# Altium schematic sheet A3000_16MB.SchDoc: ARM2 to ARM3 Adapter
size A3; DocumentNumber: 1; SheetNumber: 2; SheetTotal: 5
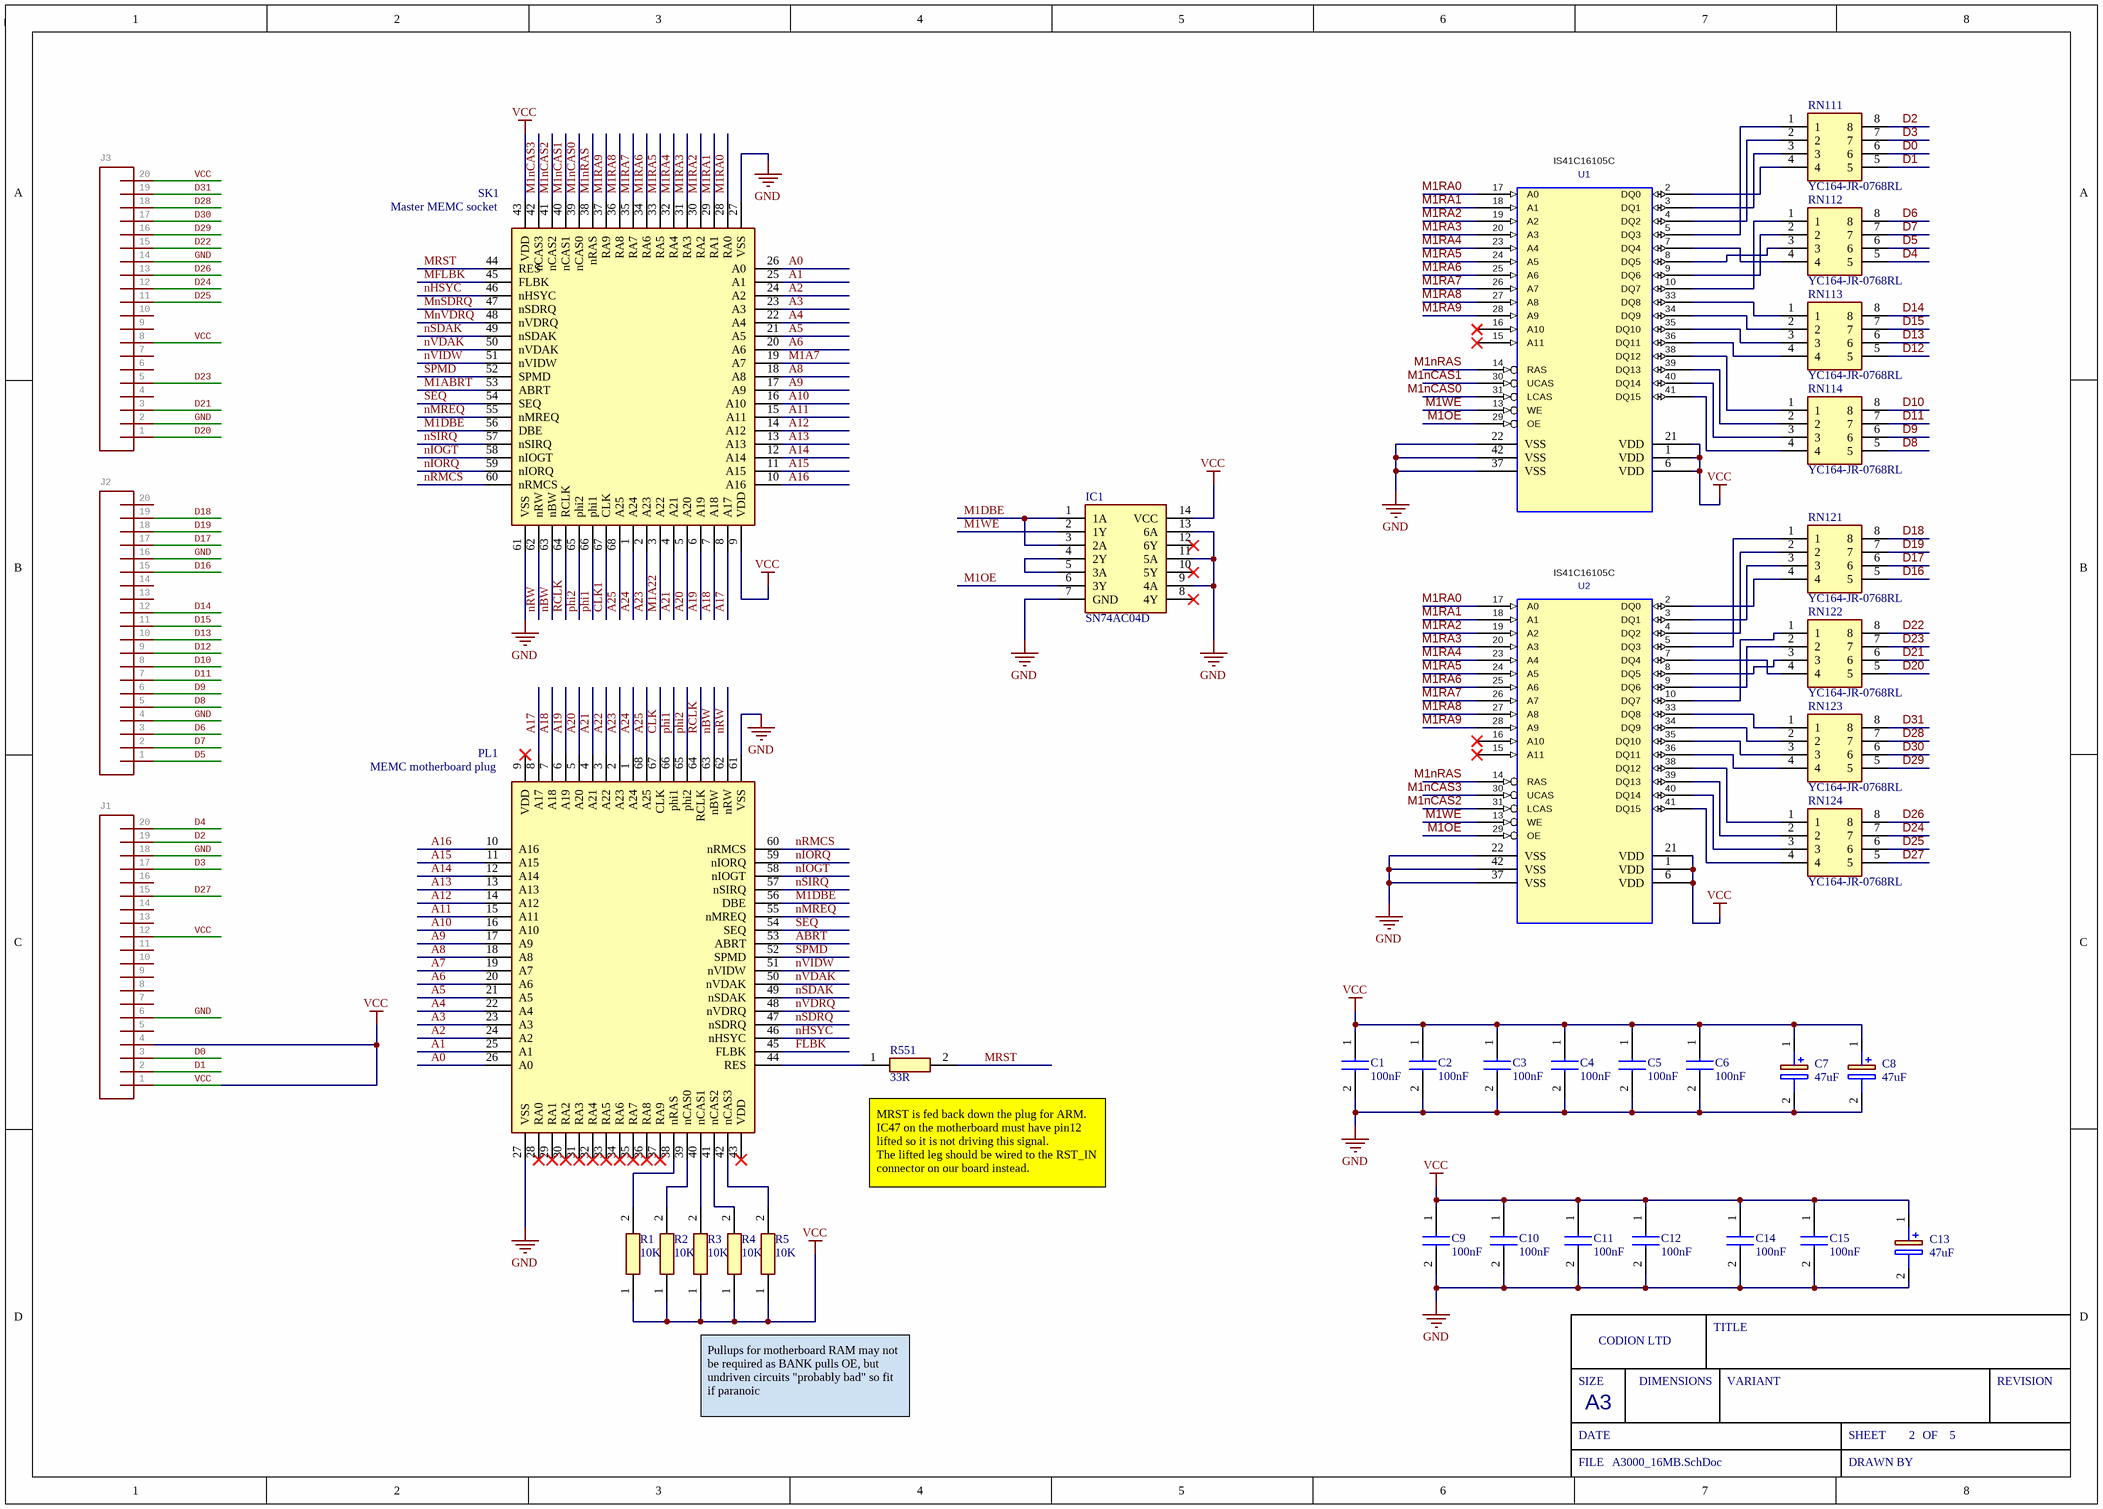
[diagram p0: A3000_16MB.SchDoc]

## Parts
C1  100nF  [CAPC2012X145N]
C2  100nF  [CAPC2012X145N]
C3  100nF  [CAPC2012X145N]
C4  100nF  [CAPC2012X145N]
C5  100nF  [CAPC2012X145N]
C6  100nF  [CAPC2012X145N]
C7  47uF  [EEE1AA101SP]
C8  47uF  [EEE1AA101SP]
C9  100nF  [CAPC2012X145N]
C10  100nF  [CAPC2012X145N]
C11  100nF  [CAPC2012X145N]
C12  100nF  [CAPC2012X145N]
C13  47uF  [EEE1AA101SP]
C14  100nF  [CAPC2012X145N]
C15  100nF  [CAPC2012X145N]
IC1  SN74AC04D  [SOIC127P600X175-14N]
J1  CONN_20  [1X20]  (value not drawn)
J2  CONN_20  [1X20]  (value not drawn)
J3  CONN_20  [1X20]  (value not drawn)
PL1  MEMC motherboard plug  [MEMC_Plug]
R1  10K  [RESC1005X40N]
R2  10K  [RESC1005X40N]
R3  10K  [RESC1005X40N]
R4  10K  [RESC1005X40N]
R5  10K  [RESC1005X40N]
R551  33R  [RESC1005X40N]
RN111  YC164-JR-0768RL  [YC164JR0768RL]
RN112  YC164-JR-0768RL  [YC164JR0768RL]
RN113  YC164-JR-0768RL  [YC164JR0768RL]
RN114  YC164-JR-0768RL  [YC164JR0768RL]
RN121  YC164-JR-0768RL  [YC164JR0768RL]
RN122  YC164-JR-0768RL  [YC164JR0768RL]
RN123  YC164-JR-0768RL  [YC164JR0768RL]
RN124  YC164-JR-0768RL  [YC164JR0768RL]
SK1  Master MEMC socket  [MEMC_Socket]
U1  IS41C16105C  [SOJ-42]
U2  IS41C16105C  [SOJ-42]

## Nets
GND: C1.2 C2.2 C3.2 C4.2 C5.2 C6.2 C7.2(-) C8.2(-) C9.2 C10.2 C11.2 C12.2 C13.2(-) C14.2 C15.2 IC1.7(GND) IC1.9(4A) IC1.11(5A) IC1.13(6A) J1.6 J1.18 J2.4 J2.16 J3.2 J3.14 PL1.27(VSS) PL1.61(VSS) SK1.27(VSS) SK1.61(VSS) U1.22(VSS) U1.37(VSS) U1.42(VSS) U2.22(VSS) U2.37(VSS) U2.42(VSS)
VCC: C1.1 C2.1 C3.1 C4.1 C5.1 C6.1 C7.1(+) C8.1(+) C9.1 C10.1 C11.1 C12.1 C13.1(+) C14.1 C15.1 IC1.14(VCC) J1.1 J1.4 J1.12 J3.8 J3.20 R1.1 R2.1 R3.1 R4.1 R5.1 SK1.9(VDD) SK1.43(VDD) U1.1(VCC) U1.6(VCC) U1.21(VCC) U2.1(VCC) U2.6(VCC) U2.21(VCC)
A0: PL1.26(A0) SK1.26(A0)
A1: PL1.25(A1) SK1.25(A1)
A2: PL1.24(A2) SK1.24(A2)
A3: PL1.23(A3) SK1.23(A3)
A4: PL1.22(A4) SK1.22(A4)
A5: PL1.21(A5) SK1.21(A5)
A6: PL1.20(A6) SK1.20(A6)
A7: PL1.19(A7)
A8: PL1.18(A8) SK1.18(A8)
A9: PL1.17(A9) SK1.17(A9)
A10: PL1.16(A10) SK1.16(A10)
A11: PL1.15(A11) SK1.15(A11)
A12: PL1.14(A12) SK1.14(A12)
A13: PL1.13(A13) SK1.13(A13)
A14: PL1.12(A14) SK1.12(A14)
A15: PL1.11(A15) SK1.11(A15)
A16: PL1.10(A16) SK1.10(A16)
A17: PL1.8(A17) SK1.8(A17)
A18: PL1.7(A18) SK1.7(A18)
A19: PL1.6(A19) SK1.6(A19)
A20: PL1.5(A20) SK1.5(A20)
A21: PL1.4(A21) SK1.4(A21)
A22: PL1.3(A22)
A23: PL1.2(A23) SK1.2(A23)
A24: PL1.1(A24) SK1.1(A24)
A25: PL1.68(A25) SK1.68(A25)
ABRT: PL1.53(ABRT)
CLK: PL1.67(CLK)
CLK1: SK1.67(CLK)
D0: J1.3 RN111.6
D1: J1.2 RN111.5
D2: J1.19 RN111.8
D3: J1.17 RN111.7
D4: J1.20 RN112.5
D5: J2.1 RN112.6
D6: J2.3 RN112.8
D7: J2.2 RN112.7
D8: J2.5 RN114.5
D9: J2.6 RN114.6
D10: J2.8 RN114.8
D11: J2.7 RN114.7
D12: J2.9 RN113.5
D13: J2.10 RN113.6
D14: J2.12 RN113.8
D15: J2.11 RN113.7
D16: J2.15 RN121.5
D17: J2.17 RN121.6
D18: J2.19 RN121.8
D19: J2.18 RN121.7
D20: J3.1 RN122.5
D21: J3.3 RN122.6
D22: J3.15 RN122.8
D23: J3.5 RN122.7
D24: J3.12 RN124.7
D25: J3.11 RN124.6
D26: J3.13 RN124.8
D27: J1.15 RN124.5
D28: J3.18 RN123.7
D29: J3.16 RN123.5
D30: J3.17 RN123.6
D31: J3.19 RN123.8
FLBK: PL1.45(FLBK)
M1A7: SK1.19(A7)
M1A22: SK1.3(A22)
M1ABRT: SK1.53(ABRT)
M1DBE: IC1.1(1A) IC1.3(2A) PL1.56(DBE) SK1.56(DBE)
M1nCAS0: SK1.39(nCAS0) U1.31(LCAS)
M1nCAS1: SK1.40(nCAS1) U1.30(UCAS)
M1nCAS2: SK1.41(nCAS2) U2.31(LCAS)
M1nCAS3: SK1.42(nCAS3) U2.30(UCAS)
M1nRAS: SK1.38(nRAS) U1.14(RAS) U2.14(RAS)
M1OE: IC1.6(3Y) U1.29(OE) U2.29(OE)
M1RA0: SK1.28(RA0) U1.17(A0) U2.17(A0)
M1RA1: SK1.29(RA1) U1.18(A1) U2.18(A1)
M1RA2: SK1.30(RA2) U1.19(A2) U2.19(A2)
M1RA3: SK1.31(RA3) U1.20(A3) U2.20(A3)
M1RA4: SK1.32(RA4) U1.23(A4) U2.23(A4)
M1RA5: SK1.33(RA5) U1.24(A5) U2.24(A5)
M1RA6: SK1.34(RA6) U1.25(A6) U2.25(A6)
M1RA7: SK1.35(RA7) U1.26(A7) U2.26(A7)
M1RA8: SK1.36(RA8) U1.27(A8) U2.27(A8)
M1RA9: SK1.37(RA9) U1.28(A9) U2.28(A9)
M1WE: IC1.2(1Y) U1.13(WE) U2.13(WE)
MFLBK: SK1.45(FLBK)
MnSDRQ: SK1.47(nSDRQ)
MnVDRQ: SK1.48(nVDRQ)
MRST: R551.2 SK1.44(RES)
nBW: PL1.63(nBW) SK1.63(nBW)
nHSYC: PL1.46(nHSYC) SK1.46(nHSYC)
nIOGT: PL1.58(nIOGT) SK1.58(nIOGT)
nIORQ: PL1.59(nIORQ) SK1.59(nIORQ)
nMREQ: PL1.55(nMREQ) SK1.55(nMREQ)
nRMCS: PL1.60(nRMCS) SK1.60(nRMCS)
nRW: PL1.62(nRW) SK1.62(nRW)
nSDAK: PL1.49(nSDAK) SK1.49(nSDAK)
nSDRQ: PL1.47(nSDRQ)
nSIRQ: PL1.57(nSIRQ) SK1.57(nSIRQ)
nVDAK: PL1.50(nVDAK) SK1.50(nVDAK)
nVDRQ: PL1.48(nVDRQ)
nVIDW: PL1.51(nVIDW) SK1.51(nVIDW)
phi1: PL1.66(phi1) SK1.66(phi1)
phi2: PL1.65(phi2) SK1.65(phi2)
RCLK: PL1.64(RCLK) SK1.64(RCLK)
SEQ: PL1.54(SEQ) SK1.54(SEQ)
SPMD: PL1.52(SPMD) SK1.52(SPMD)
NetIC1_4: IC1.4(2Y) IC1.5(3A)
NetPL1_38: PL1.38(nRAS) R1.2
NetPL1_39: PL1.39(nCAS0) R2.2
NetPL1_40: PL1.40(nCAS1) R3.2
NetPL1_41: PL1.41(nCAS2) R4.2
NetPL1_42: PL1.42(nCAS3) R5.2
NetPL1_44: PL1.44(RES) R551.1
NetRN111_1: RN111.1 U1.5(DQ3)
NetRN111_2: RN111.2 U1.4(DQ2)
NetRN111_3: RN111.3 U1.3(DQ1)
NetRN111_4: RN111.4 U1.2(DQ0)
NetRN112_1: RN112.1 U1.10(DQ7)
NetRN112_2: RN112.2 U1.9(DQ6)
NetRN112_3: RN112.3 U1.8(DQ5)
NetRN112_4: RN112.4 U1.7(DQ4)
NetRN113_1: RN113.1 U1.33(DQ8)
NetRN113_2: RN113.2 U1.34(DQ9)
NetRN113_3: RN113.3 U1.35(DQ10)
NetRN113_4: RN113.4 U1.36(DQ11)
NetRN114_1: RN114.1 U1.38(DQ12)
NetRN114_2: RN114.2 U1.39(DQ13)
NetRN114_3: RN114.3 U1.40(DQ14)
NetRN114_4: RN114.4 U1.41(DQ15)
NetRN121_1: RN121.1 U2.5(DQ3)
NetRN121_2: RN121.2 U2.4(DQ2)
NetRN121_3: RN121.3 U2.3(DQ1)
NetRN121_4: RN121.4 U2.2(DQ0)
NetRN122_1: RN122.1 U2.10(DQ7)
NetRN122_2: RN122.2 U2.9(DQ6)
NetRN122_3: RN122.3 U2.8(DQ5)
NetRN122_4: RN122.4 U2.7(DQ4)
NetRN123_1: RN123.1 U2.33(DQ8)
NetRN123_2: RN123.2 U2.34(DQ9)
NetRN123_3: RN123.3 U2.35(DQ10)
NetRN123_4: RN123.4 U2.36(DQ11)
NetRN124_1: RN124.1 U2.38(DQ12)
NetRN124_2: RN124.2 U2.39(DQ13)
NetRN124_3: RN124.3 U2.40(DQ14)
NetRN124_4: RN124.4 U2.41(DQ15)

Not connected (* = marked no-connect by the designer): IC1 8(4Y)* 10(5Y)* 12(6Y)*; J1 5 7 8 9 10 11 13 14 16; J2 13 14 20; J3 4 6 7 9 10; PL1 9(VDD)* 28(RA0)* 29(RA1)* 30(RA2)* 31(RA3)* 32(RA4)* 33(RA5)* 34(RA6)* 35(RA7)* 36(RA8)* 37(RA9)* 43(VDD)*; U1 15(A11)* 16(A10)*; U2 15(A11)* 16(A10)*

## Notes on the sheet
- (near R551) MRST is fed back down the plug for ARM.
  IC47 on the motherboard must have pin12 lifted so it is not driving this signal.
  The lifted leg should be wired to the RST_IN connector on our board instead.
- Pullups for motherboard RAM may not be required as BANK pulls OE, but undriven circuits "probably bad" so fit if paranoic
- SIZE
- CODION LTD
- DIMENSIONS
- TITLE
- VARIANT
- REVISION
- DATE
- A3
- SHEET
- OF
- FILE
- DRAWN BY

## Library data of the parts
C1-C6 C9-C12 C14 C15 = C2012X7R1H104K125AM: Capacitor; Manufacturer_Name: TDK; Datasheet Link: https://product.tdk.com/info/en/catalog/datasheets/mlcc_commercial_midvoltage_en.pdf; Height: 1.45mm; Manufacturer_Part_Number: C2012X7R1H104K125AM; Mouser Part Number: 810-C2012X7R1H104KT5; Mouser Price/Stock: https://www.mouser.com/Search/Refine.aspx?Keyword=810-C2012X7R1H104KT5; Arrow Part Number: C2012X7R1H104K125AM; Arrow Price/Stock: https://www.arrow.com/en/products/c2012x7r1h104k125am/tdk; LCSC Part #: C111492
C7 C8 C13 = EEE1VA470WP: Capacitor Polarised; Manufacturer_Name: Panasonic; Datasheet Link: http://industrial.panasonic.com/cdbs/www-data/pdf/RDE0000/ABA0000C1145.pdf; Height: 7.8mm; Manufacturer_Part_Number: EEE1VA470WP
IC1 = SN74AC04D: Integrated Circuit; Manufacturer_Name: Texas Instruments; Datasheet Link: http://www.ti.com/lit/ds/symlink/sn74ac04.pdf; Height: 1.75mm; Manufacturer_Part_Number: SN74AC04D; Mouser Part Number: 595-SN74AC04D; Mouser Price/Stock: https://www.mouser.co.uk/ProductDetail/Texas-Instruments/SN74AC04D?qs=w32V8uFkMxkvsyMHHacuZw%3D%3D; Arrow Part Number: SN74AC04D; Arrow Price/Stock: https://www.arrow.com/en/products/sn74ac04d/texas-instruments?region=nac; LCSC Part #: C352940
J1-J3 = CONN_20: GateName_1: G$1; SymbolName_1: CONN_20; LibraryName: SparkFun-Connectors; DeviceSetName: CONN_20
PL1 = MEMC_Plug: MEMC plug
R1-R5 = CRCW040210K0FKEDHP: Resistor; Manufacturer_Name: Vishay; Datasheet Link: http://www.vishay.com/docs/20035/dcrcwe3.pdf; Height: 0.4mm; Manufacturer_Part_Number: CRCW040210K0FKEDHP; Mouser Part Number: 71-CRCW040210K0FKEDH; Mouser Price/Stock: https://www.mouser.co.uk/ProductDetail/Vishay-Dale/CRCW040210K0FKEDHP?qs=FlFvgi4rxBxmIiaeyFjrkA%3D%3D; Arrow Part Number: CRCW040210K0FKEDHP; Arrow Price/Stock: https://www.arrow.com/en/products/crcw040210k0fkedhp/vishay?region=nac; LCSC Part #: C71617
R551 = CRCW040233R0FKED: Resistor; Manufacturer_Name: Vishay; Datasheet Link: http://www.vishay.com/docs/20035/dcrcwe3.pdf; Height: 0.4mm; Manufacturer_Part_Number: CRCW040233R0FKED; Mouser Part Number: 71-CRCW0402-33-E3; Mouser Price/Stock: https://www.mouser.co.uk/ProductDetail/Vishay-Dale/CRCW040233R0FKED?qs=TNtMkGKFKOyo77UGFlXIJw%3D%3D; Arrow Part Number: CRCW040233R0FKED; Arrow Price/Stock: https://www.arrow.com/en/products/crcw040233r0fked/vishay; LCSC Part #: C137880
RN111-RN114 RN121-RN124 = YC164-JR-0768RL: Resistor Network; Manufacturer_Name: KEMET; Datasheet Link: https://www.yageo.com/upload/media/product/productsearch/datasheet/rchip/PYu-YC_TC_group_51_RoHS_L_9.pdf; Height: 0.7mm; Manufacturer_Part_Number: YC164-JR-0768RL; Mouser Part Number: 603-YC164-JR-0768RL; Mouser Price/Stock: https://www.mouser.co.uk/ProductDetail/Yageo/YC164-JR-0768RL?qs=8cPjvKtxWv7AOp%2F0jDxI3w%3D%3D; Arrow Part Number: YC164-JR-0768RL; Arrow Price/Stock: https://www.arrow.com/en/products/yc164-jr-0768rl/yageo; LCSC Part #: C695188
SK1 = MEMC_Skt: MEMC socket; Manufacturer_Name: 3M; Manufacturer_Part_Number: 8468-21B1-RK-TR; Datasheet Link: https://www.arrow.com/en/products/8468-21b1-rk-tr/3m; Height: 4.6mm; Mouser Part Number: 517-8468-21B1-RK-TR; Mouser Price/Stock: https://www.mouser.co.uk/ProductDetail/3M-Electronic-Solutions-Division/8468-21B1-RK-TR?qs=X%2F%2F06fXhnJ18zOj3KK47CQ%3D%3D; Arrow Part Number: 8468-21B1-RK-TR; Arrow Price/Stock: https://www.arrow.com/en/products/8468-21b1-rk-tr/3m
U1 U2 = DRAM_1MX16_SOJ: Value: IS41C16105C